# EAGLE schematic homeboard19 (EAGLE 6.0)
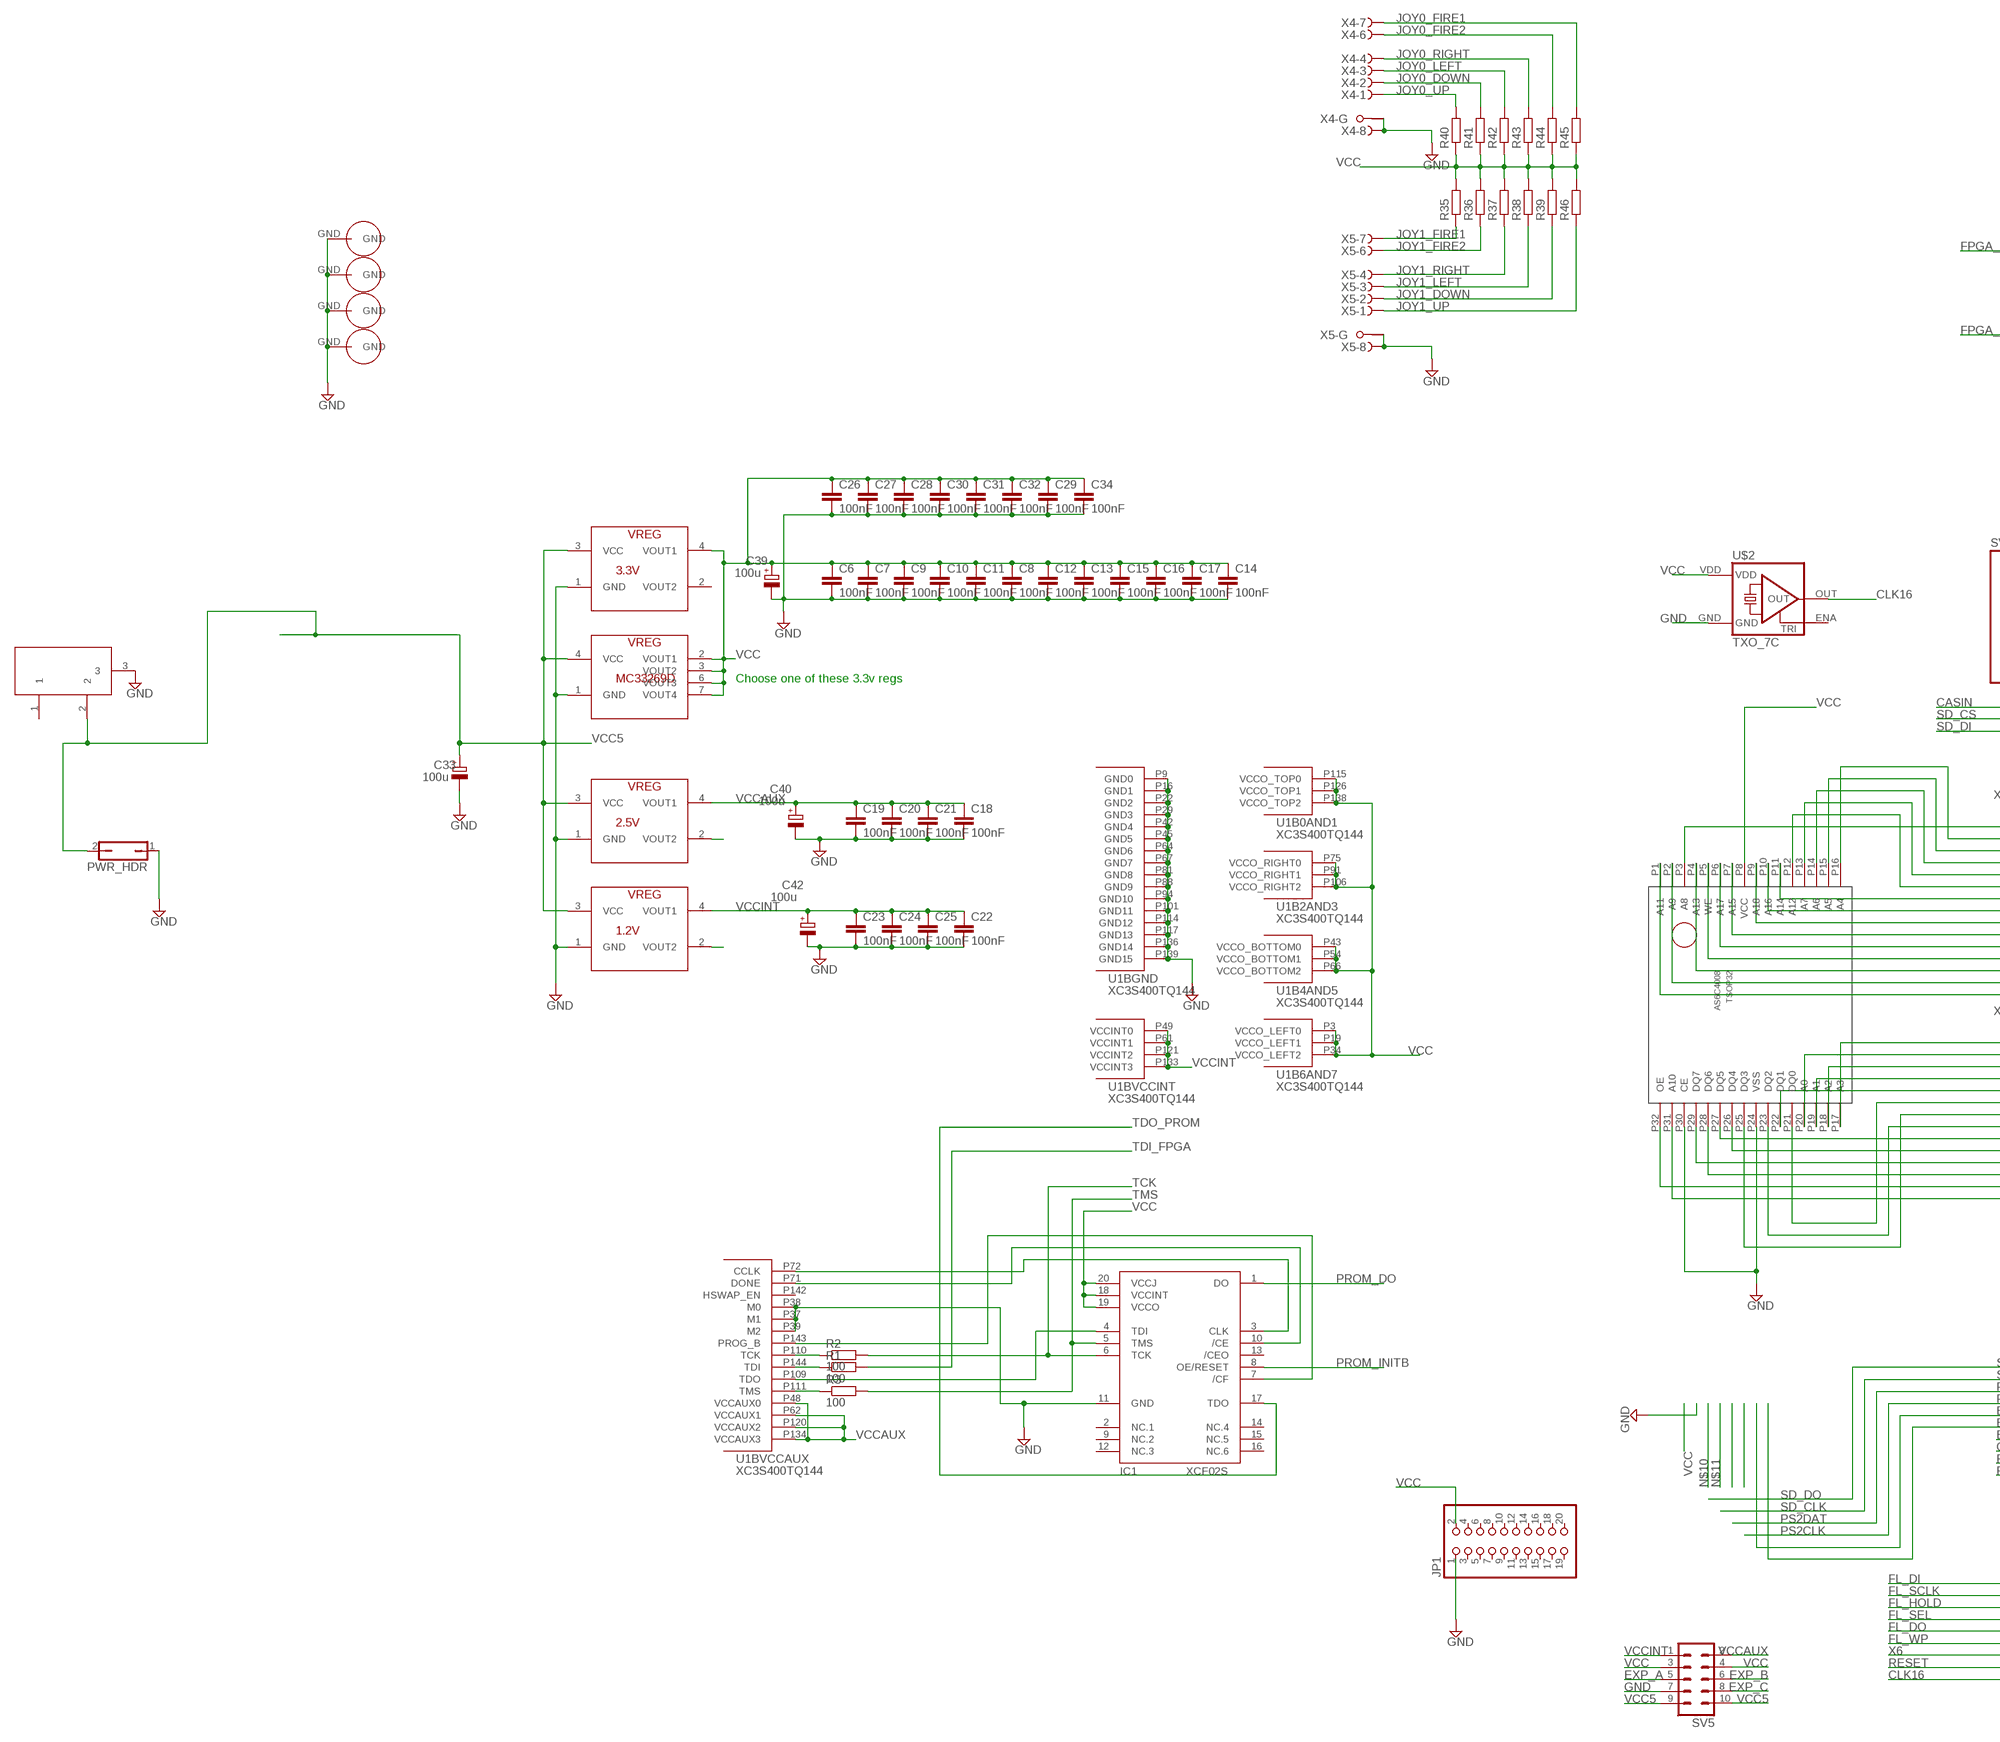
[diagram p0: schematic, sheet 1, part 1 of 3]
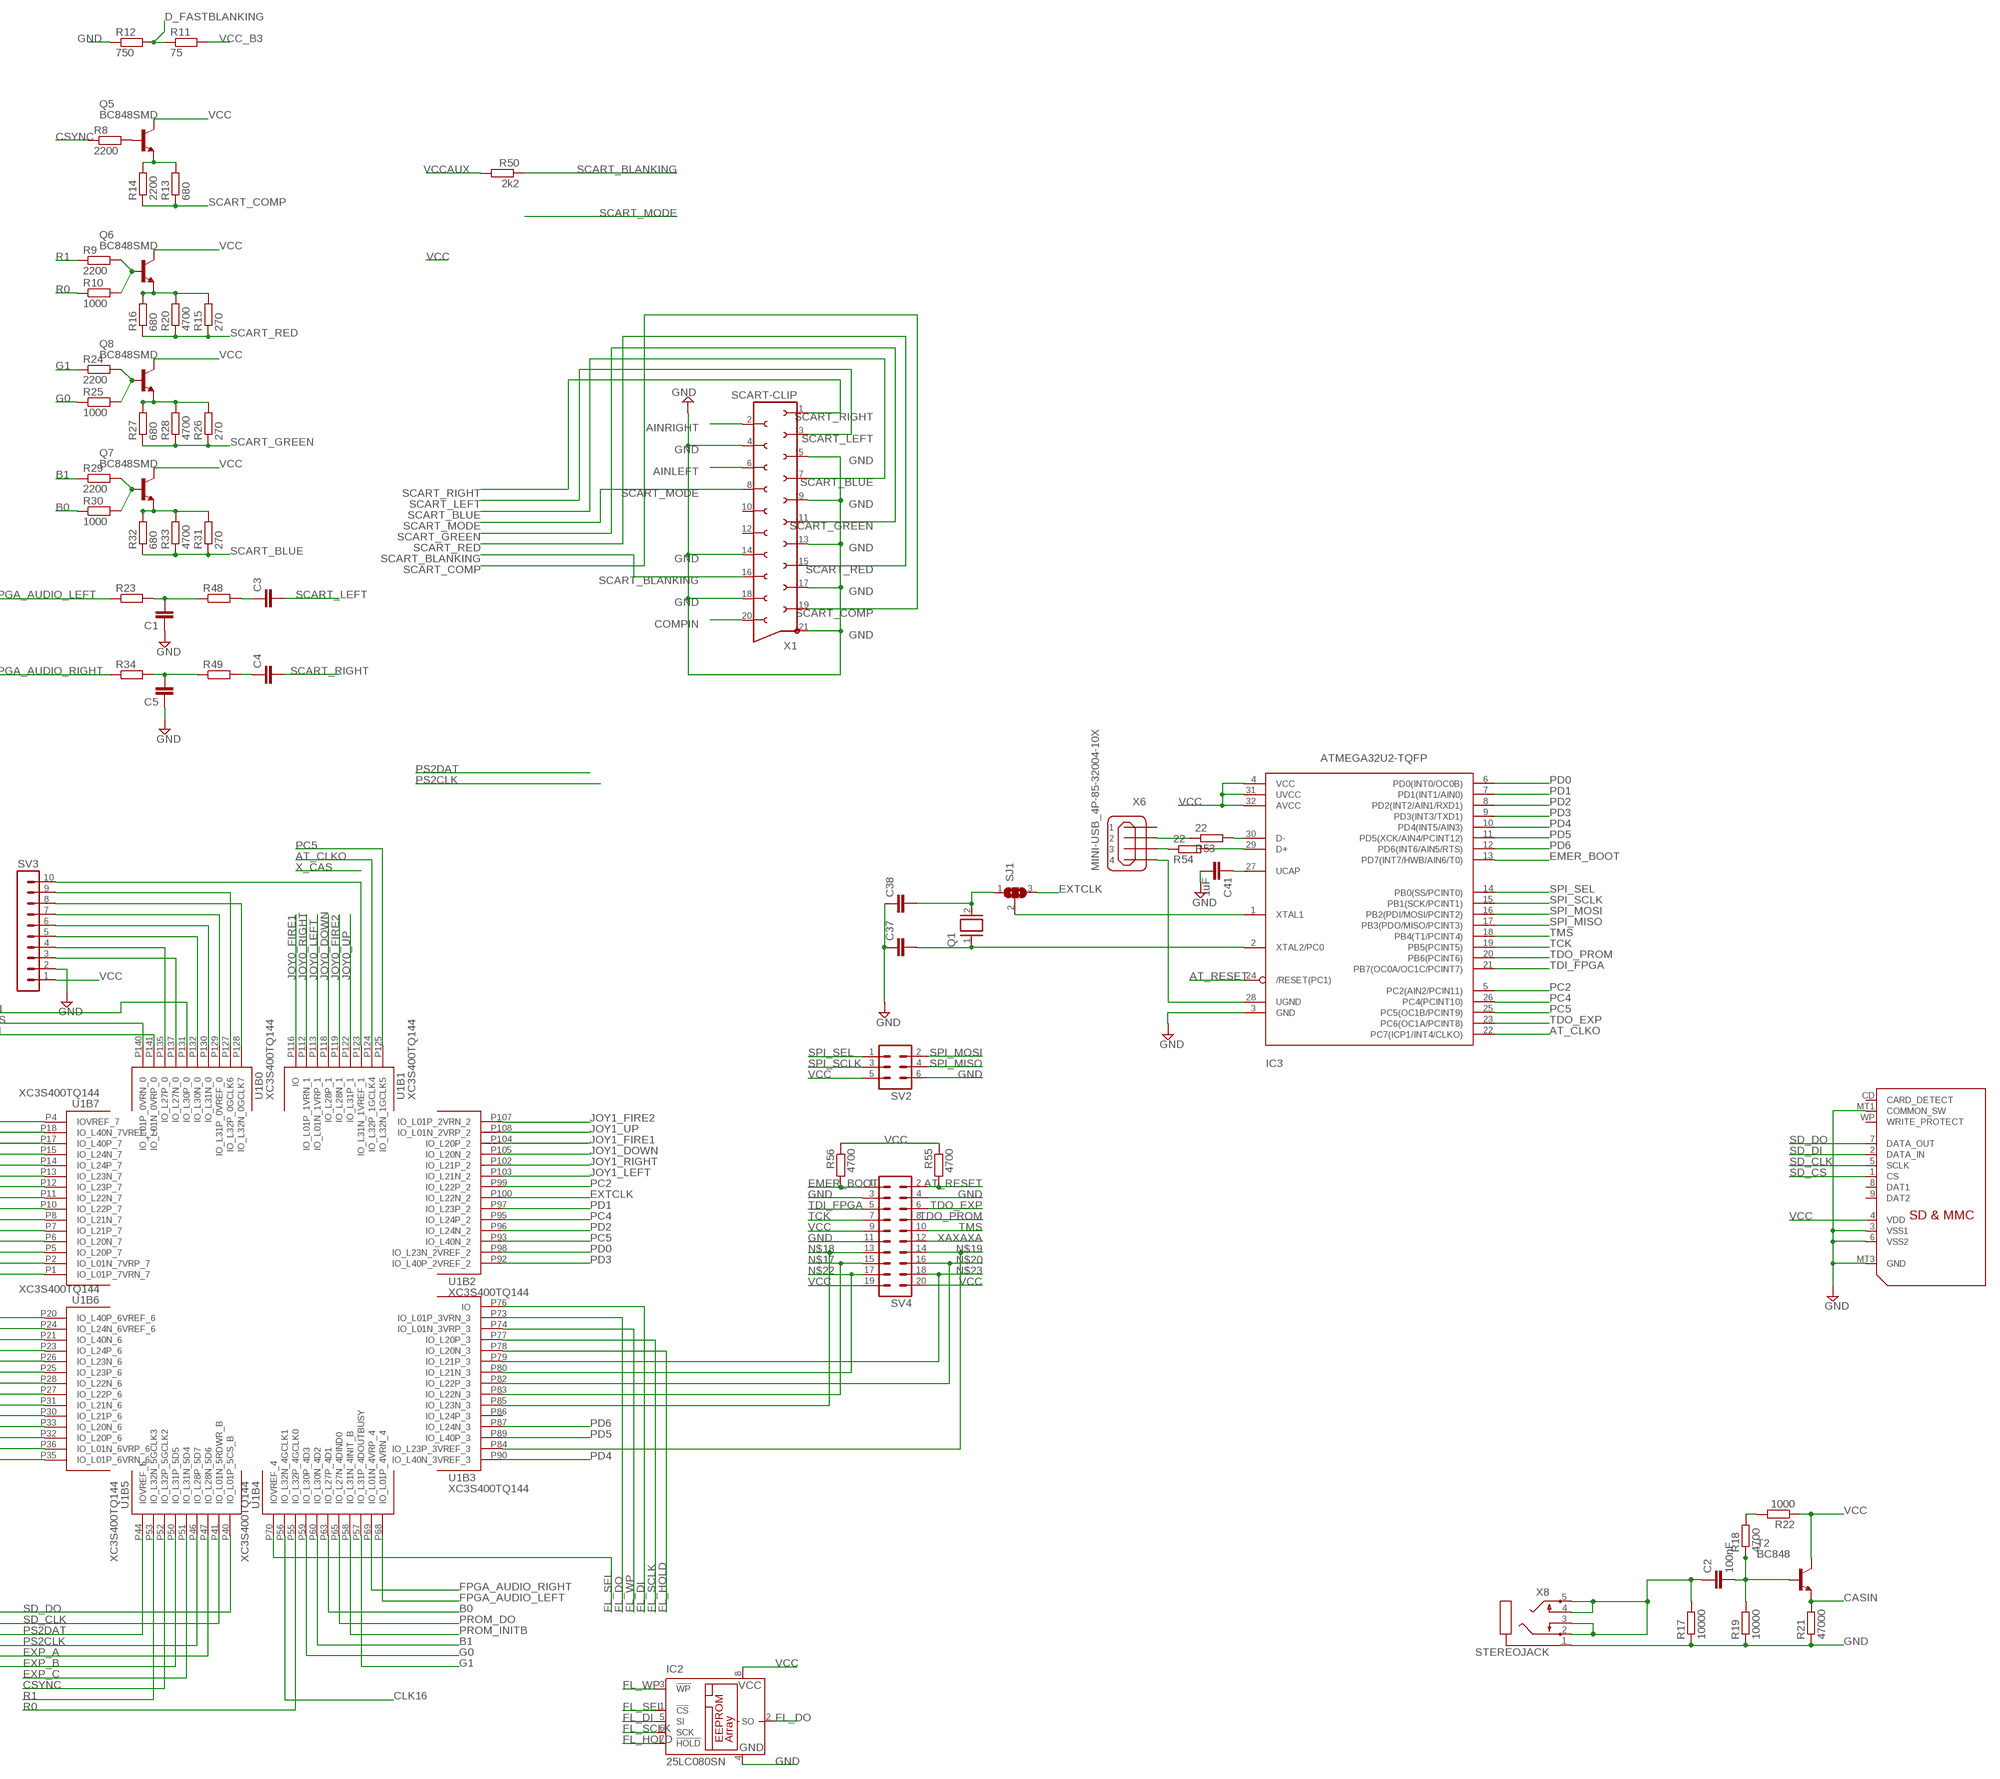
[diagram p1: schematic, sheet 1, part 2 of 3]
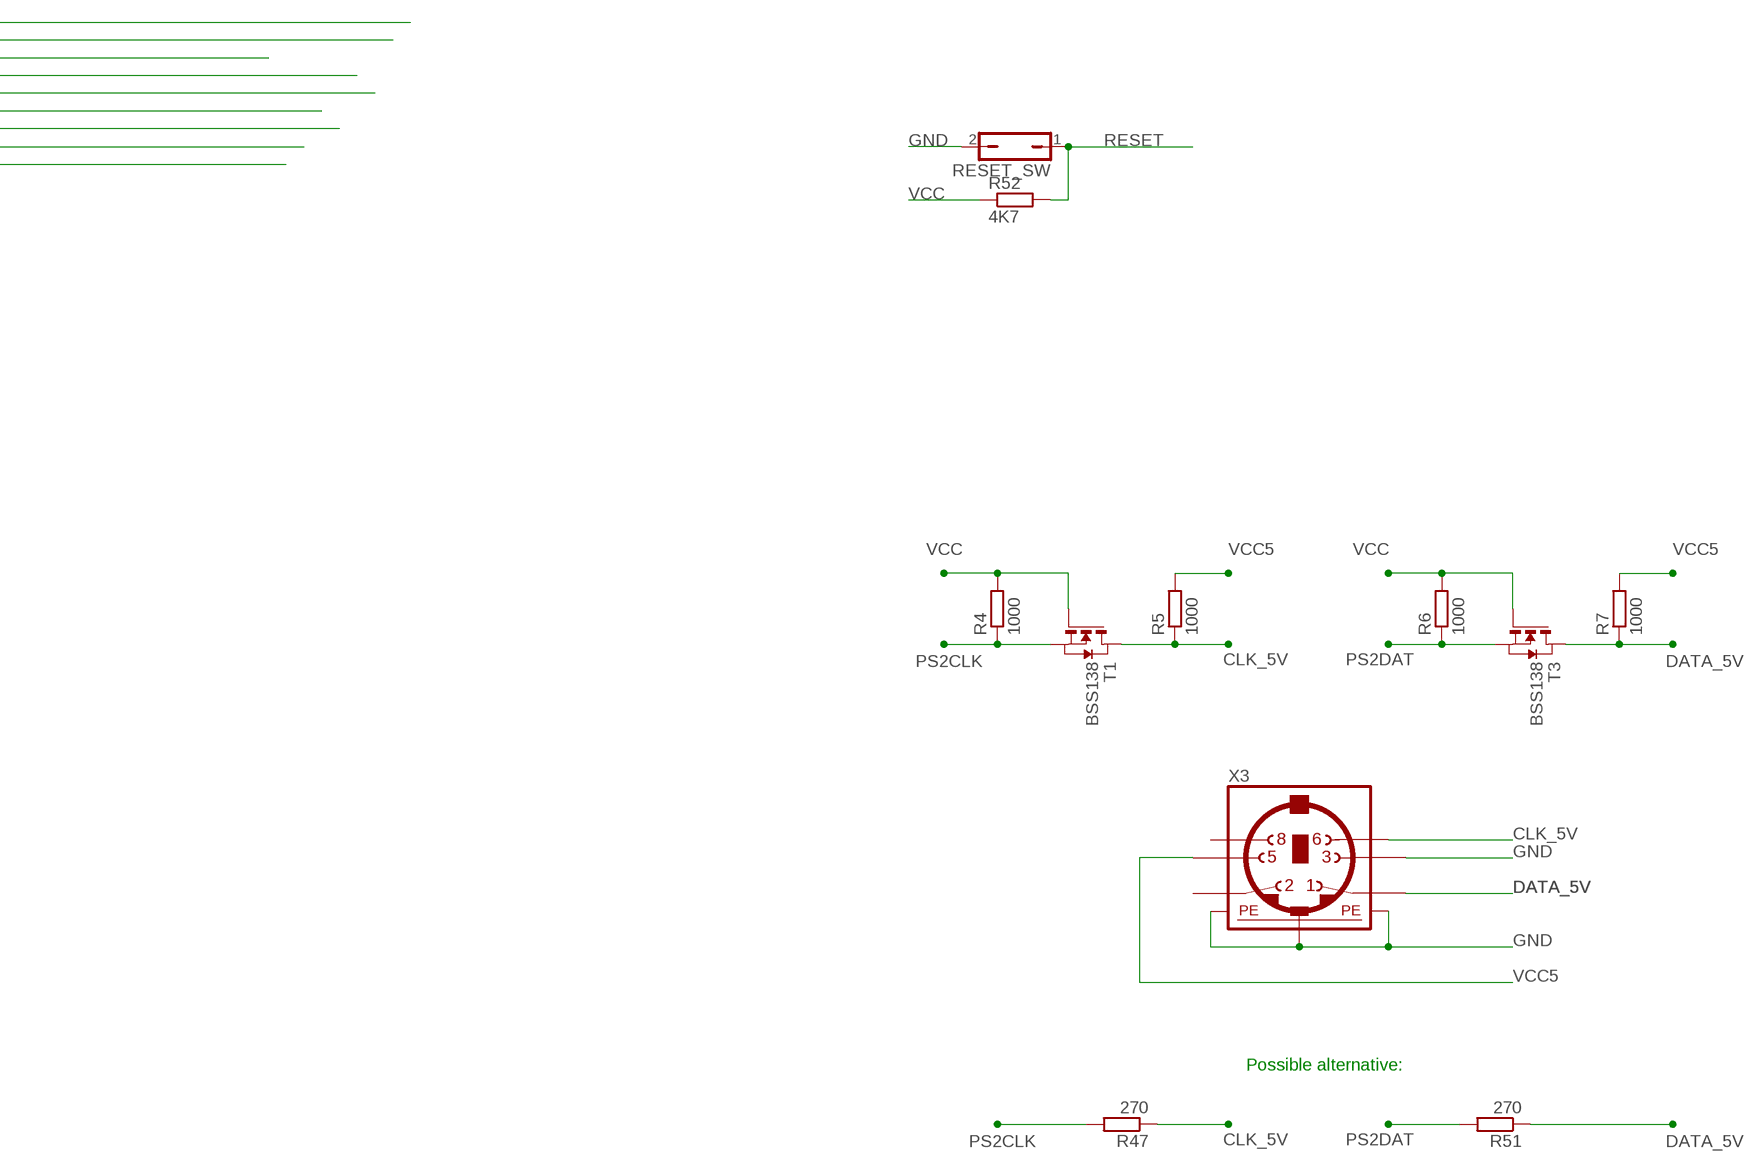
[diagram p2: schematic, sheet 1, part 3 of 3]

## Parts
C1  C-EUC0603  [C0603]
C2  100nF  C-EUC0603  [C0603]
C3  C-EUC0603  [C0603]
C4  C-EUC0603  [C0603]
C5  C-EUC0603  [C0603]
C6  100nF  C-EUC0603  [C0603]
C7  100nF  C-EUC0603  [C0603]
C8  100nF  C-EUC0603  [C0603]
C9  100nF  C-EUC0603  [C0603]
C10  100nF  C-EUC0603  [C0603]
C11  100nF  C-EUC0603  [C0603]
C12  100nF  C-EUC0603  [C0603]
C13  100nF  C-EUC0603  [C0603]
C14  100nF  C-EUC0603  [C0603]
C15  100nF  C-EUC0603  [C0603]
C16  100nF  C-EUC0603  [C0603]
C17  100nF  C-EUC0603  [C0603]
C18  100nF  C-EUC0603  [C0603]
C19  100nF  C-EUC0603  [C0603]
C20  100nF  C-EUC0603  [C0603]
C21  100nF  C-EUC0603  [C0603]
C22  100nF  C-EUC0603  [C0603]
C23  100nF  C-EUC0603  [C0603]
C24  100nF  C-EUC0603  [C0603]
C25  100nF  C-EUC0603  [C0603]
C26  100nF  C-EUC0603  [C0603]
C27  100nF  C-EUC0603  [C0603]
C28  100nF  C-EUC0603  [C0603]
C29  100nF  C-EUC0603  [C0603]
C30  100nF  C-EUC0603  [C0603]
C31  100nF  C-EUC0603  [C0603]
C32  100nF  C-EUC0603  [C0603]
C33  100u  CPOL-EUD  [PANASONIC_D]
C34  100nF  C-EUC0603  [C0603]
C37  C-EUC0805  [C0805]
C38  C-EUC0805  [C0805]
C39  100u  CPOL-EUD  [PANASONIC_D]
C40  100u  CPOL-EUD  [PANASONIC_D]
C41  1uF  C-EUC0805  [C0805]
C42  100u  CPOL-EUD  [PANASONIC_D]
IC1  XCF02S  [VO20]
IC2  25LC080SN  [SO-08]
IC3  ATMEGA32U2-TQFP  [TQFP32-08]
JP1  PINHD-2X10  [2X10]
PWR_HDR  JP1Q  [JP1]
Q1  XTAL/S  [QS]
Q5  BC848SMD  [SOT23]
Q6  BC848SMD  [SOT23]
Q7  BC848SMD  [SOT23]
Q8  BC848SMD  [SOT23]
R1  100  R-EU_R0805  [R0805]
R2  100  R-EU_R0805  [R0805]
R3  100  R-EU_R0805  [R0805]
R4  1000  R-EU_R0805  [R0805]
R5  1000  R-EU_R0805  [R0805]
R6  1000  R-EU_R0805  [R0805]
R7  1000  R-EU_R0805  [R0805]
R8  2200  R-EU_R0805  [R0805]
R9  2200  R-EU_R0805  [R0805]
R10  1000  R-EU_R0805  [R0805]
R11  75  R-EU_R0805  [R0805]
R12  750  R-EU_R0805  [R0805]
R13  680  R-EU_R0805  [R0805]
R14  2200  R-EU_R0805  [R0805]
R15  270  R-EU_R0805  [R0805]
R16  680  R-EU_R0805  [R0805]
R17  10000  R-EU_R0805  [R0805]
R18  4700  R-EU_R0805  [R0805]
R19  10000  R-EU_R0805  [R0805]
R20  4700  R-EU_R0805  [R0805]
R21  47000  R-EU_R0805  [R0805]
R22  1000  R-EU_R0805  [R0805]
R23  R-EU_M0805  [M0805]
R24  2200  R-EU_R0805  [R0805]
R25  1000  R-EU_R0805  [R0805]
R26  270  R-EU_R0805  [R0805]
R27  680  R-EU_R0805  [R0805]
R28  4700  R-EU_R0805  [R0805]
R29  2200  R-EU_R0805  [R0805]
R30  1000  R-EU_R0805  [R0805]
R31  270  R-EU_R0805  [R0805]
R32  680  R-EU_R0805  [R0805]
R33  4700  R-EU_R0805  [R0805]
R34  R-EU_M0805  [M0805]
R35  R-EU_M0805  [M0805]
R36  R-EU_M0805  [M0805]
R37  R-EU_M0805  [M0805]
R38  R-EU_M0805  [M0805]
R39  R-EU_M0805  [M0805]
R40  R-EU_M0805  [M0805]
R41  R-EU_M0805  [M0805]
R42  R-EU_M0805  [M0805]
R43  R-EU_M0805  [M0805]
R44  R-EU_M0805  [M0805]
R45  R-EU_M0805  [M0805]
R46  R-EU_M0805  [M0805]
R47  270  R-EU_R0805  [R0805]
R48  R-EU_M0805  [M0805]
R49  R-EU_M0805  [M0805]
R50  2k2  R-EU_M0805  [M0805]
R51  270  R-EU_R0805  [R0805]
R52  4K7  R-EU_M0805  [M0805]
R53  22  R-EU_R0805  [R0805]
R54  22  R-EU_R0805  [R0805]
R55  4700  R-EU_R0805  [R0805]
R56  4700  R-EU_R0805  [R0805]
REG1.2  1.2V  NX1117  [SOT223]
REG2.5  2.5V  NX1117  [SOT223]
RESET_SW  JP1Q  [JP1]
SJ1  SJ2W  [SJ_2]
SV2  MA03-2  [MA03-2]
SV3  MA10-1  [MA10-1]
SV4  MA10-2  [MA10-2]
SV5  MA05-2  [MA05-2]
T1  BSS138  NMOSSOT23  [SOT-23]
T2  BC848  [SOT23]
T3  BSS138  NMOSSOT23  [SOT-23]
U1  XC3S400TQ144  [TQ144]
U$1  GNDHOLE  [GNDHOLE]
U$2  TXO_7C  [OSC_7C]
U$3  SDMMCNOHOLE  [SDCARD-NOHOLE]
U$4  3.3V  NX1117  [SOT223]
U$5  MC33269D  [SO8]
U$6  AS6C4008  [TSOP32]
U$7  GNDHOLE  [GNDHOLE]
U$8  GNDHOLE  [GNDHOLE]
U$9  GNDHOLE  [GNDHOLE]
X1  SCART-CLIP  [SCART-CLIP]
X3  MINI_DIN_6  [M_DIN6]
X4  F09HPS  [F09HP]
X5  F09HPS  [F09HP]
X6  MINI-USB_4P-85-32004-10X  [85-32004-10X]
X7  DC21MMX  [DC-21MM]
X8  STEREOJACK  [20-0137]

## Nets
AINLEFT: X1.6
AINRIGHT: X1.2
AT_CLKO: IC3.22(PC7(ICP1/INT4/CLKO)) U1.P124(B1:IO_L32P_1GCLK4)
AT_RESET: IC3.24(/RESET(PC1)) R55.2 SV4.2
B0: R30.1 U1.P63(B4:IO_L27P_4D1)
B1: R29.1 U1.P60(B4:IO_L30N_4D2)
CASIN: R21.2 T2.2(E) U1.P131(B0:IO_L30P_0)
CLK16: U1.P56(B4:IO_L32N_4GCLK1) U$2.OUT
CLK_5V: R5.1 R47.1 T1.1(D) X3.6
COMPIN: X1.20
CSYNC: R8.1 U1.P52(B5:IO_L32P_5GCLK2)
D_FASTBLANKING: R11.1 R12.2
DATA_5V: R7.1 R51.1 T3.1(D) X3.1
EMER_BOOT: IC3.13(PD7(INT7/HWB/AIN6/T0)) R56.2 SV4.1
EXP_A: SV5.5 U1.P47(B5:IO_L28N_5D6)
EXP_B: SV5.6 U1.P50(B5:IO_L31P_5D5)
EXP_C: SV5.8 U1.P51(B5:IO_L31N_5D4)
EXTCLK: SJ1.3 U1.P100(B2:IO_L22N_2)
FL_DI: IC2.5(SI) U1.P76(B3:IO)
FL_DO: IC2.2(SO) U1.P73(B3:IO_L01P_3VRN_3)
FL_HOLD: IC2.7(!HOLD) U1.P78(B3:IO_L20N_3)
FL_SCLK: IC2.6(SCK) U1.P77(B3:IO_L20P_3)
FL_SEL: IC2.1(!CS) U1.P70(B4:IOVREF_4)
FL_WP: IC2.3(!WP) U1.P74(B3:IO_L01N_3VRP_3)
FPGA_AUDIO_LEFT: R23.1 U1.P68(B4:IO_L01P_4VRN_4)
FPGA_AUDIO_RIGHT: R34.1 U1.P69(B4:IO_L01N_4VRP_4)
G0: R25.1 U1.P59(B4:IO_L30P_4D3)
G1: R24.1 U1.P57(B4:IO_L31P_4DOUTBUSY)
GND: C1.1 C5.1 C6.2 C7.2 C8.2 C9.2 C10.2 C11.2 C12.2 C13.2 C14.2 C15.2 C16.2 C17.2 C18.2 C19.2 C20.2 C21.2 C22.2 C23.2 C24.2 C25.2 C26.2 C27.2 C28.2 C29.2 C30.2 C31.2 C32.2 C33.- C34.2 C37.1 C38.1 C39.- C40.- C41.2 C42.- IC1.11(GND) IC2.4(GND) IC3.3(GND) JP1.1 PWR_HDR.1 R12.1 R17.1 R19.1 R21.1 REG1.2.1(GND) REG2.5.1(GND) RESET_SW.2 SV2.6 SV3.2 SV4.3 SV4.4 SV4.11 SV5.7 U1.P9(BGND:GND0) U1.P16(BGND:GND1) U1.P22(BGND:GND2) U1.P29(BGND:GND3) U1.P37(BVCCAUX:M1) U1.P38(BVCCAUX:M0) U1.P39(BVCCAUX:M2) U1.P42(BGND:GND4) U1.P45(BGND:GND5) U1.P64(BGND:GND6) U1.P67(BGND:GND7) U1.P81(BGND:GND8) U1.P88(BGND:GND9) U1.P94(BGND:GND10) U1.P101(BGND:GND11) U1.P114(BGND:GND12) U1.P117(BGND:GND13) U1.P136(BGND:GND14) U1.P139(BGND:GND15) U$1.GND U$2.GND U$3.3(VSS1) U$3.6(VSS2) U$3.MT1(COMMON_SW) U$3.MT3(GND) U$4.1(GND) U$5.1(GND) U$6.P24(VSS) U$6.P30(CE) U$7.GND U$8.GND U$9.GND X1.4 X1.5 X1.9 X1.13 X1.14 X1.17 X1.18 X1.21 X3.3 X3.SH1(PE1) X3.SH2(PE2) X3.SH3(PE3) X4.8(-8:F) X4.G1(-G:G1) X5.8(-8:F) X5.G1(-G:G1) X7.3 X8.1
JOY0_DOWN: R41.2 U1.P118(B1:IO_L28P_1) X4.2(-2:F)
JOY0_FIRE1: R45.2 U1.P116(B1:IO) X4.7(-7:F)
JOY0_FIRE2: R44.2 U1.P119(B1:IO_L28N_1) X4.6(-6:F)
JOY0_LEFT: R42.2 U1.P113(B1:IO_L01N_1VRP_1) X4.3(-3:F)
JOY0_RIGHT: R43.2 U1.P112(B1:IO_L01P_1VRN_1) X4.4(-4:F)
JOY0_UP: R40.2 U1.P122(B1:IO_L31P_1) X4.1(-1:F)
JOY1_DOWN: R39.1 U1.P105(B2:IO_L20N_2) X5.2(-2:F)
JOY1_FIRE1: R35.1 U1.P104(B2:IO_L20P_2) X5.7(-7:F)
JOY1_FIRE2: R36.1 U1.P107(B2:IO_L01P_2VRN_2) X5.6(-6:F)
JOY1_LEFT: R38.1 U1.P103(B2:IO_L21N_2) X5.3(-3:F)
JOY1_RIGHT: R37.1 U1.P102(B2:IO_L21P_2) X5.4(-4:F)
JOY1_UP: R46.1 U1.P108(B2:IO_L01N_2VRP_2) X5.1(-1:F)
N$1: SV3.4 U1.P135(B0:IO_L27P_0)
N$2: SV3.5 U1.P132(B0:IO_L30N_0)
N$3: SV3.3 U1.P137(B0:IO_L27N_0)
N$4: SV3.6 U1.P130(B0:IO_L31N_0)
N$5: SV3.7 U1.P129(B0:IO_L31P_0VREF_0)
N$6: SV3.8 U1.P128(B0:IO_L32N_0GCLK7)
N$7: SV3.9 U1.P127(B0:IO_L32P_0GCLK6)
N$8: IC3.1(XTAL1) SJ1.2
N$9: C41.1 IC3.27(UCAP)
N$12: C37.2 IC3.2(XTAL2/PC0) Q1.1
N$14: C38.2 Q1.2 SJ1.1
N$16: SV3.10 U1.P123(B1:IO_L31N_1VREF_1)
N$17: SV4.15 U1.P83(B3:IO_L22N_3)
N$18: SV4.13 U1.P85(B3:IO_L23N_3)
N$19: SV4.14 U1.P84(B3:IO_L23P_3VREF_3)
N$20: SV4.16 U1.P82(B3:IO_L22P_3)
N$22: SV4.17 U1.P80(B3:IO_L21N_3)
N$23: SV4.18 U1.P79(B3:IO_L21P_3)
N$35: IC1.3(CLK) U1.P72(BVCCAUX:CCLK)
N$36: R53.1 X6.2
N$38: IC1.10(/CE) U1.P71(BVCCAUX:DONE)
N$39: R2.1 U1.P110(BVCCAUX:TCK)
N$40: IC1.7(/CF) U1.P143(BVCCAUX:PROG_B)
N$42: R1.1 U1.P144(BVCCAUX:TDI)
N$43: R3.1 U1.P111(BVCCAUX:TMS)
N$49: IC3.29(D+) R54.2
N$50: REG2.5.2(VOUT2)
N$51: C1.2 R23.2 R48.1
N$52: C3.1 R48.2
N$53: Q6.1(B) R9.2 R10.2
N$54: Q6.2(E) R15.2 R16.2 R20.2
N$55: Q8.1(B) R24.2 R25.2
N$56: Q8.2(E) R26.2 R27.2 R28.2
N$57: Q7.1(B) R29.2 R30.2
N$58: Q7.2(E) R31.2 R32.2 R33.2
N$59: Q5.2(E) R13.2 R14.2
N$60: C2.2 R18.1 R19.2 T2.1(B)
N$61: C2.1 R17.2 X8.2 X8.3 X8.4 X8.5
N$62: R18.2 R22.2
N$63: Q5.1(B) R8.2
N$64: C4.1 R49.2
N$65: C5.2 R34.2 R49.1
N$66: R54.1 X6.3
N$67: U1.P1(B7:IO_L01P_7VRN_7) U$6.P1(A11)
N$68: IC3.30(D-) R53.2
N$69: IC3.28(UGND) X6.4
N$70: REG1.2.2(VOUT2)
N$71: U1.P2(B7:IO_L01N_7VRP_7) U$6.P2(A9)
N$72: U1.P4(B7:IOVREF_7) U$6.P3(A8)
N$73: U1.P5(B7:IO_L20P_7) U$6.P4(A13)
N$74: U1.P6(B7:IO_L20N_7) U$6.P5(WE)
N$75: U1.P7(B7:IO_L21P_7) U$6.P6(A17)
N$76: U1.P8(B7:IO_L21N_7) U$6.P7(A15)
N$77: U1.P10(B7:IO_L22P_7) U$6.P9(A18)
N$78: U1.P11(B7:IO_L22N_7) U$6.P10(A16)
N$79: U1.P12(B7:IO_L23P_7) U$6.P11(A14)
N$80: U1.P13(B7:IO_L23N_7) U$6.P12(A12)
N$81: U1.P14(B7:IO_L24P_7) U$6.P13(A7)
N$82: U1.P15(B7:IO_L24N_7) U$6.P14(A6)
N$83: U1.P17(B7:IO_L40P_7) U$6.P15(A5)
N$84: U1.P18(B7:IO_L40N_7VREF_7) U$6.P16(A4)
N$85: U1.P20(B6:IO_L40P_6VREF_6) U$6.P17(A3)
N$86: U1.P21(B6:IO_L40N_6) U$6.P18(A2)
N$87: U1.P23(B6:IO_L24P_6) U$6.P19(A1)
N$88: U1.P24(B6:IO_L24N_6VREF_6) U$6.P20(A0)
N$89: U1.P25(B6:IO_L23P_6) U$6.P21(DQ0)
N$90: U1.P26(B6:IO_L23N_6) U$6.P22(DQ1)
N$91: U1.P27(B6:IO_L22P_6) U$6.P23(DQ2)
N$92: U1.P28(B6:IO_L22N_6) U$6.P25(DQ3)
N$93: U1.P30(B6:IO_L21P_6) U$6.P26(DQ4)
N$94: U1.P31(B6:IO_L21N_6) U$6.P27(DQ5)
N$95: U1.P32(B6:IO_L20P_6) U$6.P28(DQ6)
N$96: U1.P33(B6:IO_L20N_6) U$6.P29(DQ7)
N$97: U1.P35(B6:IO_L01P_6VRN_6) U$6.P31(A10)
N$98: U1.P36(B6:IO_L01N_6VRP_6) U$6.P32(OE)
PC2: IC3.5(PC2(AIN2/PCIN11)) U1.P99(B2:IO_L22P_2)
PC4: IC3.26(PC4(PCINT10)) U1.P95(B2:IO_L24P_2)
PC5: IC3.25(PC5(OC1B/PCINT9)) U1.P93(B2:IO_L40N_2) U1.P125(B1:IO_L32N_1GCLK5)
PD0: IC3.6(PD0(INT0/OC0B)) U1.P98(B2:IO_L23N_2VREF_2)
PD1: IC3.7(PD1(INT1/AIN0)) U1.P97(B2:IO_L23P_2)
PD2: IC3.8(PD2(INT2/AIN1/RXD1)) U1.P96(B2:IO_L24N_2)
PD3: IC3.9(PD3(INT3/TXD1)) U1.P92(B2:IO_L40P_2VREF_2)
PD4: IC3.10(PD4(INT5/AIN3)) U1.P90(B3:IO_L40N_3VREF_3)
PD5: IC3.11(PD5(XCK/AIN4/PCINT12)) U1.P89(B3:IO_L40P_3)
PD6: IC3.12(PD6(INT6/AIN5/RTS)) U1.P87(B3:IO_L24N_3)
PROM_DO: IC1.1(DO) U1.P65(B4:IO_L27N_4DIND0)
PROM_INITB: IC1.8(OE/RESET) U1.P58(B4:IO_L31N_4INIT_B)
PS2CLK: R4.1 R47.2 T1.2(S) U1.P46(B5:IO_L28P_5D7)
PS2DAT: R6.1 R51.2 T3.2(S) U1.P44(B5:IOVREF_5)
R0: R10.1 U1.P55(B4:IO_L32P_4GCLK0)
R1: R9.1 U1.P53(B5:IO_L32N_5GCLK3)
RESET: R52.2 RESET_SW.1
SCART_BLANKING: R50.1 X1.16
SCART_BLUE: R31.1 R32.1 R33.1 X1.7
SCART_COMP: R13.1 R14.1 X1.19
SCART_GREEN: R26.1 R27.1 R28.1 X1.11
SCART_LEFT: C3.2 X1.3
SCART_MODE: X1.8
SCART_RED: R15.1 R16.1 R20.1 X1.15
SCART_RIGHT: C4.2 X1.1
SD_CLK: U1.P41(B5:IO_L01N_5RDWR_B) U$3.5(SCLK)
SD_CS: U1.P140(B0:IO_L01P_0VRN_0) U$3.1(CS)
SD_DI: U1.P141(B0:IO_L01N_0VRP_0) U$3.2(DATA_IN)
SD_DO: U1.P40(B5:IO_L01P_5CS_B) U$3.7(DATA_OUT)
SPI_MISO: IC3.17(PB3(PDO/MISO/PCINT3)) SV2.4
SPI_MOSI: IC3.16(PB2(PDI/MOSI/PCINT2)) SV2.2
SPI_SCLK: IC3.15(PB1(SCK/PCINT1)) SV2.3
SPI_SEL: IC3.14(PB0(SS/PCINT0)) SV2.1
TCK: IC1.6(TCK) IC3.19(PB5(PCINT5)) R2.2 SV4.7
TDI_FPGA: IC3.21(PB7(OC0A/OC1C/PCINT7)) R1.2 SV4.5
TDO_EXP: IC3.23(PC6(OC1A/PCINT8)) SV4.6
TDO_FPGA: IC1.4(TDI) U1.P109(BVCCAUX:TDO)
TDO_PROM: IC1.17(TDO) IC3.20(PB6(PCINT6)) SV4.8
TMS: IC1.5(TMS) IC3.18(PB4(T1/PCINT4)) R3.2 SV4.10
VCC: C6.1 C7.1 C8.1 C9.1 C10.1 C11.1 C12.1 C13.1 C14.1 C15.1 C16.1 C17.1 C26.1 C27.1 C28.1 C29.1 C30.1 C31.1 C32.1 C34.1 C39.+ IC1.18(VCCINT) IC1.19(VCCO) IC1.20(VCCJ) IC2.8(VCC) IC3.4(VCC) IC3.31(UVCC) IC3.32(AVCC) JP1.2 Q5.3(C) Q6.3(C) Q7.3(C) Q8.3(C) R4.2 R6.2 R22.1 R35.2 R36.2 R37.2 R38.2 R39.2 R40.1 R41.1 R42.1 R43.1 R44.1 R45.1 R46.2 R52.1 R55.1 R56.1 SV2.5 SV3.1 SV4.9 SV4.19 SV4.20 SV5.3 SV5.4 T1.3(G) T2.3(C) T3.3(G) U1.P3(B6AND7:VCCO_LEFT0) U1.P19(B6AND7:VCCO_LEFT1) U1.P34(B6AND7:VCCO_LEFT2) U1.P43(B4AND5:VCCO_BOTTOM0) U1.P54(B4AND5:VCCO_BOTTOM1) U1.P66(B4AND5:VCCO_BOTTOM2) U1.P75(B2AND3:VCCO_RIGHT0) U1.P91(B2AND3:VCCO_RIGHT1) U1.P106(B2AND3:VCCO_RIGHT2) U1.P115(B0AND1:VCCO_TOP0) U1.P126(B0AND1:VCCO_TOP1) U1.P138(B0AND1:VCCO_TOP2) U$2.VDD U$3.4(VDD) U$4.4(VOUT1) U$5.2(VOUT1) U$5.3(VOUT2) U$5.6(VOUT3) U$5.7(VOUT4) U$6.P8(VCC)
VCC5: C33.+ PWR_HDR.2 R5.2 R7.2 REG1.2.3(VCC) REG2.5.3(VCC) SV5.9 SV5.10 U$4.3(VCC) U$5.4(VCC) X3.5 X7.2
VCC_B3: R11.2
VCCAUX: C18.1 C19.1 C20.1 C21.1 C40.+ R50.2 REG2.5.4(VOUT1) SV5.2 U1.P48(BVCCAUX:VCCAUX0) U1.P62(BVCCAUX:VCCAUX1) U1.P120(BVCCAUX:VCCAUX2) U1.P134(BVCCAUX:VCCAUX3)
VCCINT: C22.1 C23.1 C24.1 C25.1 C42.+ REG1.2.4(VOUT1) SV5.1 U1.P49(BVCCINT:VCCINT0) U1.P61(BVCCINT:VCCINT1) U1.P121(BVCCINT:VCCINT2) U1.P133(BVCCINT:VCCINT3)
XAXAXA: SV4.12
Unconnected: IC1.2(NC.1) IC1.9(NC.2) IC1.12(NC.3) IC1.13(/CEO) IC1.14(NC.4) IC1.15(NC.5) IC1.16(NC.6) JP1.3 JP1.4 JP1.5 JP1.6 JP1.7 JP1.8 JP1.9 JP1.10 JP1.11 JP1.12 JP1.13 JP1.14 JP1.15 JP1.16 JP1.17 JP1.18 JP1.19 JP1.20 U1.P86(B3:IO_L24P_3) U1.P142(BVCCAUX:HSWAP_EN) U$2.ENA(TRI) U$3.8(DAT1) U$3.9(DAT2) U$3.CD(CARD_DETECT) U$3.WP(WRITE_PROTECT) U$4.2(VOUT2) X1.10 X1.12 X3.2 X3.8 X4.5(-5:F) X4.9(-9:F) X4.G2(-G:G2) X5.5(-5:F) X5.9(-9:F) X5.G2(-G:G2) X6.1

## Notes on the sheet
- Choose one of these 3.3v regs
- Possible alternative:

## Power pins joined to a net without a drawn wire
1: X7.1

## Library data of the parts
C1-C5 = resistor:C-EU: CAPACITOR, European symbol
C6-C32 C34 C37 C38 C41 = rcl:C-EU: CAPACITOR, European symbol
C33 C39 C40 C42 = rcl:CPOL-EU: POLARIZED CAPACITOR, European symbol
IC1 = smd-special:XCF02S
IC2 = microchip:25*: Serial EEPROM 4K/ 8K , SPI bus; MF: MICROCHIP; MPN: 25LC080/SN; OC_FARNELL: 1137302; OC_NEWARK: 96K4092
IC3 = adafruit:ATMEGA32U2: ATmega32u2 Pin compatible with the atmega8u2, atmega16u2 and atmega32u2 8, 16 or 32 K flash, 1K RAM, 512b EEPROM 8 bit and 16 bit timer (5 PWM total) UART, SPI (no I2C!) USB with 4 endpoints, LUFA compatible 22 I/O lines, analog comparator (no ADC!) Comes with DFU bootloader burned in!
JP1 = pinhead:PINHD-2X10: PIN HEADER
PWR_HDR RESET_SW = jumper:JP1Q: JUMPER
Q1 = special:XTAL/S: CRYSTAL
Q5-Q8 = bc548:BC848*: NPN Transistor
R1-R22 R24-R33 R47 R51 R53-R56 = rcl:R-EU_: RESISTOR, European symbol
R23 R34-R46 R48-R50 R52 = resistor:R-EU_: RESISTOR, European symbol
REG1.2 REG2.5 U$4 = cpcfpga:NX1117
SJ1 = jumper:SJ2W: SMD solder JUMPER
SV2 = con-lstb:MA03-2: PIN HEADER; OC_FARNELL: unknown; OC_NEWARK: unknown
SV3 = con-lstb:MA10-1: PIN HEADER; OC_FARNELL: unknown; OC_NEWARK: unknown
SV4 = con-lstb:MA10-2: PIN HEADER; OC_FARNELL: unknown; OC_NEWARK: unknown
SV5 = con-lstb:MA05-2: PIN HEADER; OC_FARNELL: unknown; OC_NEWARK: unknown
T1 T3 = zetex:NMOSSOT23: MOS FET; OC_FARNELL: unknown; OC_NEWARK: unknown
T2 = transistor:BC848: NPN TRANSISTOR
U1 = xilinx_spartan3_virtex4_and_5:XC3S400TQ144: Xilinx FPGA
U$1 U$7-U$9 = cpcfpga:GNDHOLE
U$2 = cpcfpga:TXO_7C: TXC crystal oscillator http://www.txccrystal.com/images/pdf/7c.pdf
U$3 = cpcfpga:SDMMC: SD MMC Card holder 4UCON part #06132 - easy to solder
U$5 = cpcfpga:MC33269D
U$6 = cpcfpga:AS6C4008
X1 = cpcfpga:SCART-CLIP: TV SCART CONNECTOR; OC_FARNELL: unknown; OC_NEWARK: unknown
X3 = mini_din:MINI_DIN_6
X4 X5 = con-subd:F09HPS: SUB-D; OC_FARNELL: unknown; OC_NEWARK: unknown
X6 = con-cypressindustries:MINI-USB_4P-: MINI USB 4 Pol. Source: www.cypressindustries.com; OC_FARNELL: unknown; OC_NEWARK: unknown
X7 = powersupply:DC21MM
X8 = cpcfpga:STEREOJACK: MIC/HEADPHONE JACK Stereo jack with two switches. Kycon STX3100, CUI SJ1-3555NG and/or 4UCon 05544 modified from adafruit library

## Net classes
1 power: width 0.6 mm, drill 1.1 mm, clearance 0.4 mm
2 gnd: width 0.305 mm, drill 0.508 mm, clearance 0.152 mm